# EAGLE design SparkFun GPS NEO_M9N_SMA _LONG (EAGLE 9.5.2)
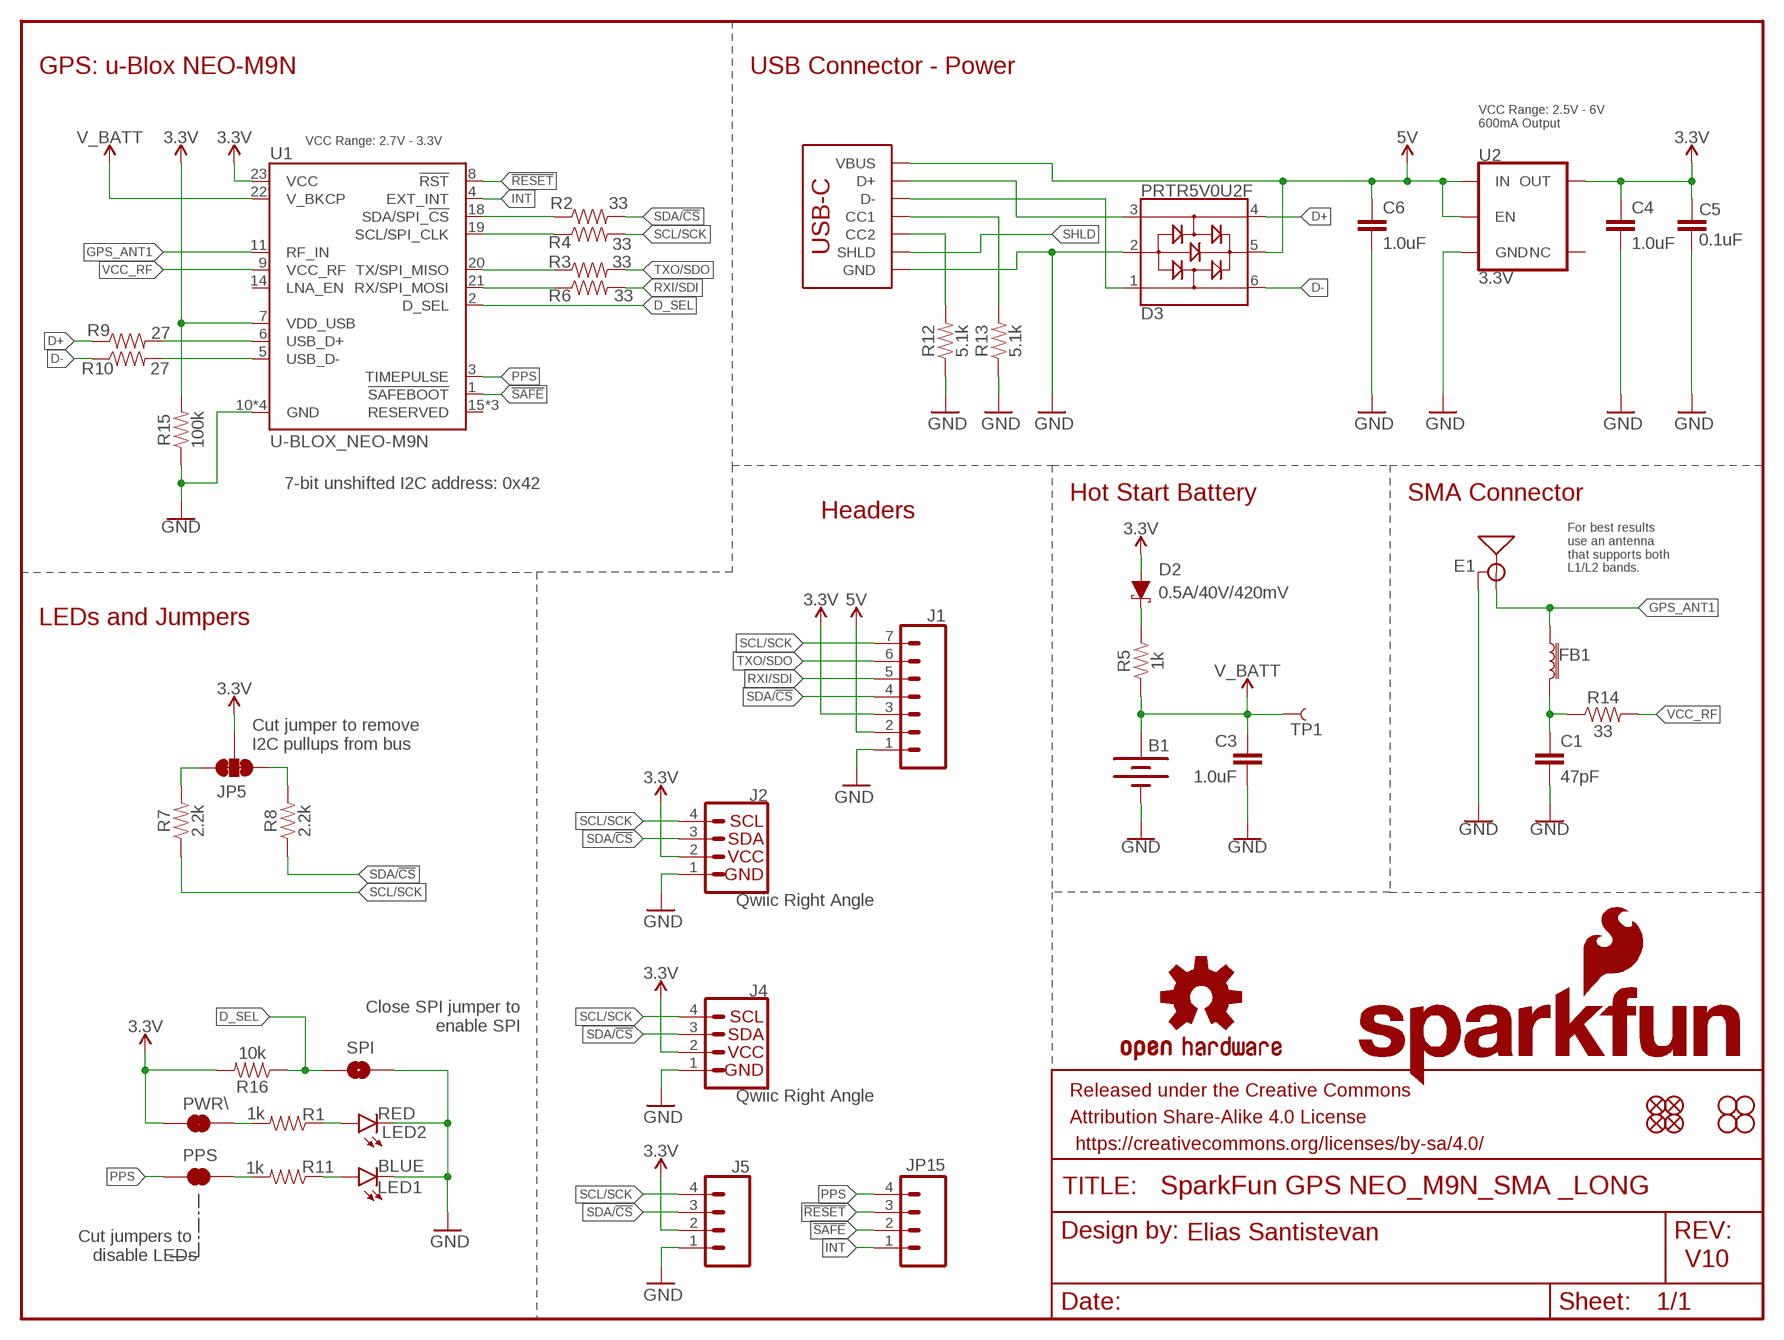
[diagram p0: schematic, sheet 1]

## Parts
B1  6.8MM_COIN_CELL  ML414H_IV01E_BATTERY  [ML414H_IV01E]
C1  47pF  47PF-0402-25V-5%-X7R  [0402]
C3  1.0uF  1.0UF-0603-16V-10%  [0603]
C4  1.0uF  1.0UF-0603-16V-10%  [0603]
C5  0.1uF  0.1UF-0603-25V-(+80/-20%)  [0603]
C6  1.0uF  1.0UF-0603-16V-10%  [0603]
D2  0.5A/40V/420mV  DIODE-SCHOTTKY-PMEG4005EJ  [SOD-323]
D3  PRTR5V0U2F  [SOT886]
E1  ANTENNA-GROUNDEDEDGE_RPSMA_SMD  [SMA-EDGE-SMD]
FB1  FERRITE_BEAD-120_OHM-0402  [0402]
FRAME1  FRAME-LETTER  [CREATIVE_COMMONS]
J1  CONN_07NO_SILK  [1X07_NO_SILK]
J2  Qwiic Right Angle  I2C_STANDARDQWIIC  [JST04_1MM_RA]
J3  USB_C_2-LAYER_PADS  [USB-C-16P-2LAYER-PADS]
J4  Qwiic Right Angle  I2C_STANDARDQWIIC  [JST04_1MM_RA]
J5  CONN_041X04_NO_SILK_NO_POP  [1X04_NO_SILK]
JP1  STAND-OFF  [STAND-OFF]
JP5  JUMPER-SMT_3_2-NC_TRACE_SILK  [SMT-JUMPER_3_2-NC_TRACE_SILK]
JP15  CONN_041X04_NO_SILK_NO_POP  [1X04_NO_SILK]
JP21  FIDUCIALUFIDUCIAL  [MICRO-FIDUCIAL]
JP31  STAND-OFF  [STAND-OFF]
JP61  FIDUCIALUFIDUCIAL  [MICRO-FIDUCIAL]
JP71  FIDUCIALUFIDUCIAL  [MICRO-FIDUCIAL]
JP81  FIDUCIALUFIDUCIAL  [MICRO-FIDUCIAL]
JP91  STAND-OFF  [STAND-OFF]
JP101  STAND-OFF  [STAND-OFF]
LED1  BLUE  LED-BLUE0603  [LED-0603]
LED2  RED  LED-RED0603  [LED-0603]
LOGO1  OSHW-LOGOMINI  [OSHW-LOGO-MINI]
LOGO2  SFE_LOGO_NAME_FLAME.1_INCH  [SFE_LOGO_NAME_FLAME_.1]
PPS  JUMPER-SMT_2_NC_TRACE_SILK  [SMT-JUMPER_2_NC_TRACE_SILK]
PWR\  JUMPER-SMT_2_NC_TRACE_SILK  [SMT-JUMPER_2_NC_TRACE_SILK]
R1  1k  1KOHM-0603-1/10W-1%  [0603]
R2  33  33OHM-0603-1/10W-1%  [0603]
R3  33  33OHM-0603-1/10W-1%  [0603]
R4  33  33OHM-0603-1/10W-1%  [0603]
R5  1k  1KOHM-0603-1/10W-1%  [0603]
R6  33  33OHM-0603-1/10W-1%  [0603]
R7  2.2k  2.2KOHM-0603-1/10W-1%  [0603]
R8  2.2k  2.2KOHM-0603-1/10W-1%  [0603]
R9  27  27OHM-0603-1/10W-1%  [0603]
R10  27  27OHM-0603-1/10W-1%  [0603]
R11  1k  1KOHM-0603-1/10W-1%  [0603]
R12  5.1k  5.1KOHM5.1KOHM-0603-1/10W-1%  [0603]
R13  5.1k  5.1KOHM5.1KOHM-0603-1/10W-1%  [0603]
R14  33  33OHM-0402-1/10W-1%  [0402]
R15  100k  100KOHM-0603-1/10W-1%  [0603]
R16  10k  10KOHM-0402-1/16W-1%  [0402]
SPI  JUMPER-SMT_2_NO_SILK  [SMT-JUMPER_2_NO_SILK]
TP1  TEST-POINT3X4  [PAD.03X.04]
U1  U-BLOX_NEO-M9N  [NEO-M9N/M8T/M8U]
U2  3.3V  V_REG_AP2112K-3.3V  [SOT23-5]

## Nets
3.3V [3.3V]: C4.1 C5.2 D2.A J1.3 J2.2 J4.2 J5.2 JP5.2 PWR\.2 R15.2 R16.2 U1.7(VDD_USB) U1.23(VCC) U2.5(OUT)
5V: C6.1 D3.5 J1.2 J3.VBUS1(VBUS) J3.VBUS2(VBUS) U2.1(IN) U2.3(EN)
!RESET: JP15.3 U1.8(!RST)
!SAFE: JP15.2 U1.1(!SAFEBOOT!)
D+: D3.4 R9.1
D-: D3.6 R10.1
D_SEL: R16.1 SPI.2 U1.2(D_SEL)
GND: B1.- C1.2 C3.2 C4.2 C5.1 C6.2 D3.2 E1.GND@0(GND) E1.GND@1(GND) J1.1 J2.1 J3.GND J3.GND2(GND) J4.1 J5.1 LED1.C LED2.C R12.1 R13.1 R15.1 SPI.1 U1.10(GND) U1.12(GND) U1.13(GND) U1.24(GND) U2.2(GND)
GPS_ANT1 [Antenna]: E1.SIG(SIGNAL) FB1.1 U1.11(RF_IN)
INT: JP15.1 U1.4(EXT_INT)
N$1: PWR\.1 R1.2
N$2: LED1.A R11.1
N$3: C1.1 FB1.2 R14.1
N$4: PPS.1 R11.2
N$5: JP5.1 R8.2
N$6: D2.C R5.2
N$7: J3.B5(CC2) R12.2
N$8: JP5.3 R7.2
N$9: J3.A5(CC1) R13.2
N$10: LED2.A R1.1
N$11: R9.2 U1.6(USB_D+)
N$12: R10.2 U1.5(USB_D-)
PPS: JP15.4 PPS.2 U1.3(TIMEPULSE)
RXI/SDI: J1.5 R6.2
RXLV: R6.1 U1.21(RX/SPI_MOSI)
SCL/SCK: J1.7 J2.4 J4.4 J5.4 R4.2 R7.1
SCL_LV: R4.1 U1.19(SCL/SPI_CLK)
SDA/!CS: J1.4 J2.3 J4.3 J5.3 R2.2 R8.1
SDA_LV: R2.1 U1.18(SDA/SPI_!CS!)
SHLD: J3.SHLD1(SHLD) J3.SHLD2(SHLD) J3.SHLD3(SHLD) J3.SHLD4(SHLD)
TXLV: R3.1 U1.20(TX/SPI_MISO)
TXO/SDO: J1.6 R3.2
USB_D+: D3.3 J3.A6(D+) J3.B6(D+)
USB_D-: D3.1 J3.A7(D-) J3.B7(D-)
V_BATT: B1.+ C3.1 R5.1 TP1.P$1 U1.22(V_BKCP)
VCC_RF: R14.2 U1.9(VCC_RF)
Unconnected: U1.14(LNA_EN) U1.15(RESERVED) U1.16(RESERVED) U1.17(RESERVED) U2.4(NC)

## Notes on the sheet
- GPS: u-Blox NEO-M9N | USB Connector - Power
- VCC Range: 2.5V - 6V 
  600mA Output
- VCC Range: 2.7V - 3.3V
- 7-bit unshifted I2C address: 0x42
- Hot Start Battery | SMA Connector
- Headers
- For best results
  use an antenna
  that supports both
  L1/L2 bands.
- LEDs and Jumpers
- Cut jumper to remove 
  I2C pullups from bus
- Close SPI jumper to
  enable SPI
- Cut jumpers to 
  disable LEDs
- Elias Santistevan
- V10

## Library data of the parts
B1 = SparkFun-Batteries:ML414H_IV01E_BATTERY: SEIKO ML414H-IV01E Reflowable Lithium Battery ML414H is a rechargeable, coin type battery with features such as Pb-free reflowable (Peak temperature: 260 C) and high temperature heat resistance. Battery Characteristics: 3.1V max voltage Voff is 2V 1mAH 3k series resistor with battery 72 hour charge time from 2.0-3.1V 2.3-2.8V initial charge; PROD_ID: BATT-14267
C1 = SparkFun-Capacitors:47PF: 47pF ceramic capacitors A capacitor is a passive two-terminal electrical component used to store electrical energy temporarily in an electric field.; PROD_ID: CAP-15063
C3 C4 C6 = SparkFun-Capacitors:1.0UF: 1µF ceramic capacitors A capacitor is a passive two-terminal electrical component used to store electrical energy temporarily in an electric field.; PROD_ID: CAP-00868
C5 = SparkFun-Capacitors:0.1UF: 0.1µF ceramic capacitors A capacitor is a passive two-terminal electrical component used to store electrical energy temporarily in an electric field.; PROD_ID: CAP-00810
D2 = SparkFun-DiscreteSemi:DIODE-SCHOTTKY: Schottky diode A Schottky diode is a semiconductor diode which has a low forward voltage drop and a very fast switching action.; PROD_ID: DIO-10955
D3 = SparkFun-IC-Power:PRTR5V0U2: A small ESD protection device. Most commonly used on USB D+/D- signals to protect large, expensive, or especially sensitive USB enabled devices.; PROD_ID: DIO-14084
E1 = SparkFun-RF:ANTENNA-GROUNDED: Antenna w/ Ground Connection 2.4GHz antennae with signal and ground terminals. TRACE_ANTENNA_2.4GHZ_15.2MM - Meander Trace antenna 15.2 x 5.7mm footprint Based on layout from TI app note AN043 <http://www.ti.com/lit/an/swra117d/swra117d.pdf>. TRACE_ANTENNA_2.4GHZ_25.7MM - Inverted F trace antenna 25.7 x 7.5 mm footprint. Based on layout from TI design note DN0007 <http://www.ti.com/lit/an/swru120b/swru120b.pdf>.; PROD_ID: CONN-15101
FB1 = SparkFun-Coils:FERRITE_BEAD-120_OHM: Ferrite Bead (blocks, cores, rings, chokes, etc.) Inductor with layers of ferrite used to suppress high frequencies. Often used to isolate high frequency noise.; MFG_PART: BLM15HB121SN1D; PROD_ID: NDUC-14206
FRAME1 = SparkFun-Aesthetics:FRAME-LETTER: Schematic Frame - Letter Standard 8.5x11 US Letter frame
J1 = SparkFun-Connectors:CONN_07: Multi connection point. Often used as Generic Header-pin footprint for 0.1 inch spaced/style header connections On any of the 0.1 inch spaced packages, you can populate with these: Break Away Headers - Straight <https://www.sparkfun.com/products/116> (PRT-00116) Break Away Male Headers - Right Angle <https://www.sparkfun.com/products/553> (PRT-00553) Female Headers <https://www.sparkfun.com/products/115> (PRT-00115) Break Away Headers - Machine Pin <https://www.sparkfun.com/products/117> (PRT-00117) Break Away Female Headers - Swiss Machine Pin <https://www.sparkfun.com/products/743> (PRT-00743) For SCREWTERMINALS and SPRING TERMINALS visit here: Screw Terimnals on SparkFun.com <https://www.sparkfun.com/search/results?term=Screw+Terminals> (5mm/3.5mm/2.54mm spacing) This device is also useful as a general connection point to wire up your design to another part of your project. Our various solder wires solder well into these plated through hole pads. Hook-Up Wire - Assortment (Stranded, 22 AWG) <https://www.sparkfun.com/products/11375> (PRT-11375) Hook-Up Wire - Assortment (Solid Core, 22 AWG) <https://www.sparkfun.com/products/11367> (PRT-11367) View the entire wire category on our website here <https://www.sparkfun.com/categories/141> Special notes: Molex polarized connector foot print use with SKU : PRT-08231 with associated crimp pins and housings. 1MM SMD Version SKU: PRT-10208 NOTES ON THE VARIANTS LOCK and LOCK_LONGPADS... This footprint was designed to help hold the alignment of a through-hole component (i.e. 6-pin header) while soldering it into place. You may notice that each hole has been shifted either up or down by 0.005 of an inch from it's more standard position (which is a perfectly straight line). This slight alteration caused the pins (the squares in the middle) to touch the edges of the holes. Because they are alternating, it causes a "brace" to hold the component in place. 0.005 has proven to be the perfect amount of "off-center" position when using our standard breakaway headers. Although looks a little odd when you look at the bare footprint, once you have a header in there, the alteration is very hard to notice. Also,if you push a header all the way into place, it is covered up entirely on the bottom side.
J2 J4 = SparkFun-Connectors:I2C_STANDARD: SparkFun I2C Standard Pinout Header SparkFun has standardized on a pinout for all I2C based sensor breakouts. This pinout allows I2C boards to be plugged directly into the headers on Arduino Uno compatible boards, and to be daisy chained easily. Example SparkFun Products: SparkFun Atmospheric Sensor Breakout - BME280 <https://www.sparkfun.com/products/13676> SparkFun Altitude/Pressure Sensor Breakout - MPL3115A2 <https://www.sparkfun.com/products/11084> SparkFun TOF Range Finder Sensor - VL6180 <https://www.sparkfun.com/products/12785>; PROD_ID: CONN-13694
J3 = SparkFun-Connectors:USB_C: USB Type C 16Pin Connector Super Speed pins not available on the 16-pin purely SMD connector so this part is best for USB 2.0 implementations. D1 and D2 are tied together enabling D+/- no matter which way the cable is plugged into the connector. The two channel configuration pins (CC1/2) are exposed. These are normally connected to ground via 5.1k resistors but can be reconfigured for high current/high power applications.; PROD_ID: CONN-14122
J5 JP15 = SparkFun-Connectors:CONN_04: Multi connection point. Often used as Generic Header-pin footprint for 0.1 inch spaced/style header connections On any of the 0.1 inch spaced packages, you can populate with these: Break Away Headers - Straight <https://www.sparkfun.com/products/116> (PRT-00116) Break Away Male Headers - Right Angle <https://www.sparkfun.com/products/553> (PRT-00553) Female Headers <https://www.sparkfun.com/products/115> (PRT-00115) Break Away Headers - Machine Pin <https://www.sparkfun.com/products/117> (PRT-00117) Break Away Female Headers - Swiss Machine Pin <https://www.sparkfun.com/products/743> (PRT-00743) For SCREWTERMINALS and SPRING TERMINALS visit here: Screw Terimnals on SparkFun.com <https://www.sparkfun.com/search/results?term=Screw+Terminals> (5mm/3.5mm/2.54mm spacing) This device is also useful as a general connection point to wire up your design to another part of your project. Our various solder wires solder well into these plated through hole pads. Hook-Up Wire - Assortment (Stranded, 22 AWG) <https://www.sparkfun.com/products/11375> (PRT-11375) Hook-Up Wire - Assortment (Solid Core, 22 AWG) <https://www.sparkfun.com/products/11367> (PRT-11367) View the entire wire category on our website here <https://www.sparkfun.com/categories/141> Special notes: Molex polarized connector foot print use with SKU : PRT-08231 with associated crimp pins and housings. 1MM SMD Version SKU: PRT-10208
JP1 JP31 JP91 JP101 = SparkFun:STAND-OFF: Stand Off This is the mechanical footprint for a #4 phillips button head screw. Use the keepout ring to avoid running the screw head into surrounding components. SKU : PRT-00447
JP5 = SparkFun-Jumpers:JUMPER-SMT_3_2-NC_TRACE: Normally closed trace jumper (2 of 2 connections) This jumper has a trace between all three pads so they are normally closed (NC). Use a razor knife to open the connection(s). For best results follow the IPC guidelines for cutting traces: Cutout at least 0.063 mm (0.005 in). Remove all loose material to clean up the cut area. Seal the cut with an approved epoxy. Reapply solder to reclose the connection(s).
JP21 JP61 JP71 JP81 = SparkFun:FIDUCIAL: Fiducial Alignment Points Various fiducial points for machine vision alignment.
LED1 = SparkFun-LED:LED-BLUE: Blue SMD LED Used in manufacturing of various products at SparkFun Packages: 0603 - SMD 0603 package [Product Link] <http://www.digikey.com/product-detail/en/SMLE12BC7TT86/511-1589-2-ND/1641808> 1206 - SMD1206 package [Product Link] <http://www.digikey.com/product-detail/en/lite-on-inc/LTST-C150TBKT/160-1643-1-ND/573584> SparkFun Products: ESP8266 Thing-Dev Board <https://www.sparkfun.com/products/13711> RedBoard <https://www.sparkfun.com/products/12757>; PROD_ID: DIO-08575
LED2 = SparkFun-LED:LED-RED: Red SMD LED Used in manufacturing of most products at SparkFun Packages: 0603 - SMD 0603 package [Product Link] <http://docs.avagotech.com/docs/AV02-0551EN> 0603 SMART - SMD 0603 SMART package ( more efficient and expensive)[Product Link] <http://www.osram-os.com/Graphics/XPic2/00077099_0.pdf> 1206 - SMD1206 package [Product Link] <https://www.sparkfun.com/datasheets/DevTools/LilyPad/Q150OVS4.pdff> SparkFun Products: Pro Mini 328 -5V <https://www.sparkfun.com/products/821> RedBoard <https://www.sparkfun.com/products/12757> IOIO-OTG <https://www.sparkfun.com/products/13613>; PROD_ID: DIO-00819
LOGO1 = SparkFun-Aesthetics:OSHW-LOGO: Open-Source Hardware (OSHW) Logo This logo indicates the piece of hardware it is found on incorporates a OSHW license and/or adheres to the definition of open source hardware found here: http://freedomdefined.org/OSHW
LOGO2 = SparkFun-Aesthetics:SFE_LOGO_NAME_FLAME: SparkFun Font Logo w/ Flame This is the SparkFun full logo. The logo on the schematic will always be the same size; the package variant is the height of the flame part of the logo. Default layer for the logo on the board is tSilk.
PPS PWR\ = SparkFun-Jumpers:JUMPER-SMT_2_NC_TRACE: Normally closed trace jumper This jumper has a trace between two pads so it's normally closed (NC). Use a razor knife to open the connection. For best results follow the IPC guidelines for cutting traces: Cutout at least 0.063 mm (0.005 in). Remove all loose material to clean up the cut area. Seal the cut with an approved epoxy. Reapply solder to reclose the connection.
R1 R5 R11 = SparkFun-Resistors:1KOHM: 1kΩ resistor A resistor is a passive two-terminal electrical component that implements electrical resistance as a circuit element. Resistors act to reduce current flow, and, at the same time, act to lower voltage levels within circuits. - Wikipedia; PROD_ID: RES-07856
R2-R4 R6 = SparkFun-Resistors:33OHM: 33Ω resistor A resistor is a passive two-terminal electrical component that implements electrical resistance as a circuit element. Resistors act to reduce current flow, and, at the same time, act to lower voltage levels within circuits. - Wikipedia; PROD_ID: RES-08270
R7 R8 = SparkFun-Resistors:2.2KOHM: 2.2kΩ resistor A resistor is a passive two-terminal electrical component that implements electrical resistance as a circuit element. Resistors act to reduce current flow, and, at the same time, act to lower voltage levels within circuits. - Wikipedia; PROD_ID: RES-08272
R9 R10 = SparkFun-Resistors:27OHM: 27Ω resistor A resistor is a passive two-terminal electrical component that implements electrical resistance as a circuit element. Resistors act to reduce current flow, and, at the same time, act to lower voltage levels within circuits. - Wikipedia; PROD_ID: RES-09334
R12 R13 = SparkFun-Resistors:5.1KOHM; PROD_ID: RES-12083
R14 = SparkFun-Resistors:33OHM: 33Ω resistor A resistor is a passive two-terminal electrical component that implements electrical resistance as a circuit element. Resistors act to reduce current flow, and, at the same time, act to lower voltage levels within circuits. - Wikipedia; PROD_ID: RES-14883
R15 = SparkFun-Resistors:100KOHM: 100kΩ resistor A resistor is a passive two-terminal electrical component that implements electrical resistance as a circuit element. Resistors act to reduce current flow, and, at the same time, act to lower voltage levels within circuits. - Wikipedia; PROD_ID: RES-07828
R16 = SparkFun-Resistors:10KOHM: 10kΩ resistor A resistor is a passive two-terminal electrical component that implements electrical resistance as a circuit element. Resistors act to reduce current flow, and, at the same time, act to lower voltage levels within circuits. - Wikipedia; PROD_ID: RES-14241
SPI = SparkFun-Jumpers:JUMPER-SMT_2_NO: Normally open jumper This jumper has two pads in close proximity to each other. Apply solder to close the connection. Round pads are easier to solder for beginners, but are a lot larger. SparkFun Product that uses the round pads: SparkFun EL Sequencer <https://www.sparkfun.com/products/12781>
TP1 = SparkFun-Connectors:TEST-POINT: SparkFun Test Points Bare copper test points for troubleshooting or In-Circuit-Testing. These are used by our Production team for verifying production board runs using pogo-pins on test beds. SparkFun Products: SparkFun LSM9DS1 Breakout <https://www.sparkfun.com/products/13284> SparkFun PSOC <https://www.sparkfun.com/products/13714> SparkFun Load Cell Amplifier <https://www.sparkfun.com/products/13879>
U1 = SparkFun-GPS:U-BLOX_NEO-M9N: u-blox NEO-M9N GPS Module The NEO-M9N module is built on the robust u-blox M9 GNSS chip, which provides exceptional sensitivity and acquisition times for all L1 GNSS systems. The u-blox M9 standard precision GNSS platform, which delivers meter-level accuracy, succeeds the well-known u-blox M8 product range. The receiver also provides higher navigation rate and improved security features compared to previous u-blox GNSS generations. The NEO-M9N module is available in the NEO form factor LLC package; PROD_ID: IC-14651
U2 = SparkFun-IC-Power:V_REG_AP2112: AP2112 - 600mA CMOS LDO Regulator w/ Enable The AP2112 is CMOS process low dropout linear regulator with enable function, the regulator delivers a guaranteed 600mA (min.) continuous load current. Features Output Voltage Accuracy: ±1.5% Output Current: 600mA (Min.) Foldback Short Current Protection: 50mA Enable Function to Turn ON/OFF VOUT Low Dropout Voltage (3.3V): 250mV (Typ.) @IOUT=600mA Excellent Load Regulation: 0.2%/A (Typ.) Excellent Line Regulation: 0.02%/V (Typ.) Low Quiescent Current: 55μA (Typ.) Low Standby Current: 0.01μA (Typ.) Low Output Noise: 50μVRMS PSRR: 100Hz -65dB, 1kHz -65dB OTSD Protection Stable with 1.0μF Flexible Cap: Ceramic, Tantalum and Aluminum Electrolytic Operation Temperature Range: -40°C to 85°C ESD: MM 400V, HBM 4000V; PROD_ID: VREG-12457

## Net classes
1 vcc: width 0.152 mm
2 3.3V: width 0.508 mm
3 Antenna: width 1 mm, clearance 0.3 mm

## Board
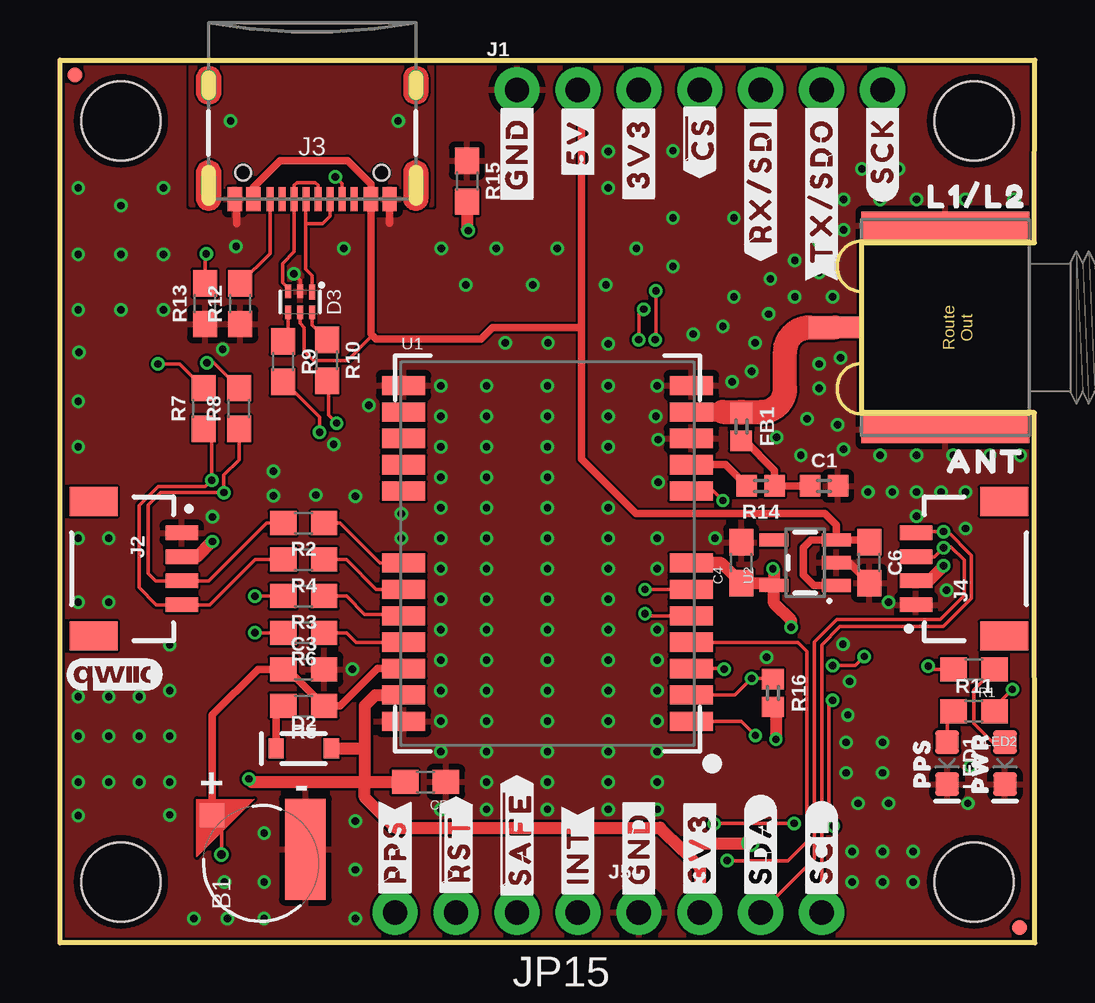
[diagram p1: board, top side]
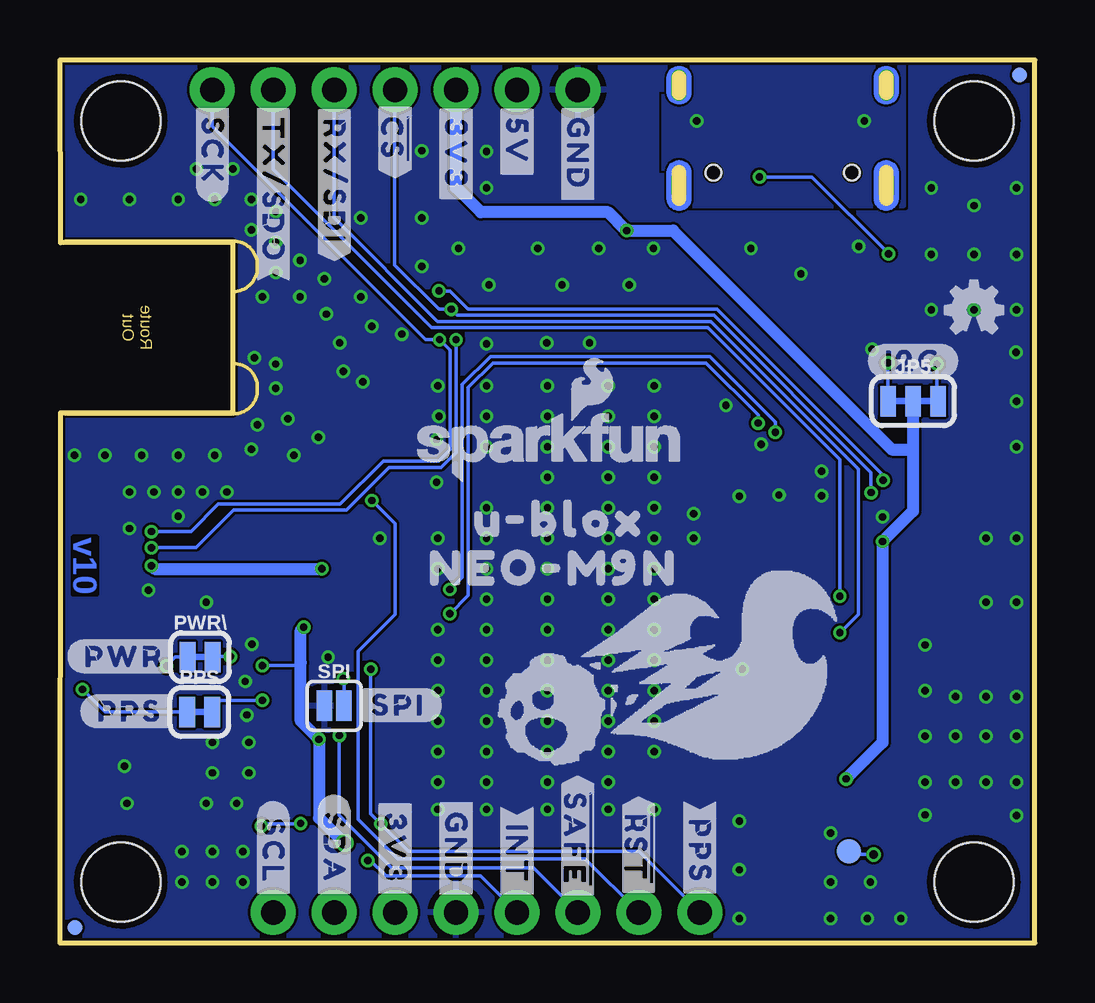
[diagram p2: board, bottom side, seen from below]

Size 40.64 x 36.8 mm. Coordinates in mm from the lower left corner, seen from the top.
Outline: 0,0 0,36.8 40.64,36.8 40.62,29.18 33.43,29.18 33.43,22.1 40.62,22.1 40.64,0 0,0
Copper layers (1*16): Top 0.035mm / dielectric 1.5mm / Bottom 0.035mm
Design rules "SparkFun-2-layer-FAB-LIMIT": minimum track width 4mil, minimum drill 6mil, track to track 4mil, track to pad 4mil, pad to pad 4mil, via to via 4mil, smd to smd 4mil, copper to edge 4mil, drill to drill 4mil, minimum pad ring 5mil, minimum via ring 5mil, stop-mask expansion 4mil, vias tented up to drill 25mil, thermal gap 10mil

### Footprints (pad centres in the part's own frame; a part is rotated, then mirrored left to right if it is on the bottom)
ML414H_IV01E = smd 1 x 1: + 2.022,2.032 | smd 4.2 x 1.7: - 0.6,-1.85
0402 = smd 0.85 x 0.9: 1 -0.58,0; 2 0.58,0
0603 = smd 1.1 x 1: 1 -0.85,0; 2 0.85,0
SOD-323 = smd 0.63 x 0.83: A 1.15,0; C -1.15,0
SOT886 = smd 0.61 x 0.25: 1 -0.405,0.5 | smd 0.56 x 0.25: 2 -0.43,0; 3 -0.43,-0.5; 4 0.43,-0.5; 5 0.43,0; 6 0.43,0.5
SMA-EDGE-SMD = smd 1.15 x 7: GND@0 -4.25,-3.5; GND@1 4.25,-3.5 | smd 0.9 x 2.2: SIG 0,-8.1
1X07_NO_SILK = drill 1.016 pad 1.88: 1 0,0; 2 2.54,0; 3 5.08,0; 4 7.62,0; 5 10.16,0; 6 12.7,0; 7 15.24,0
JST04_1MM_RA = smd 0.6 x 1.35: 1 -1.5,0; 2 -0.5,0; 3 0.5,0; 4 1.5,0 | smd 1.2 x 2: NC1 2.8,-3.675; NC2 -2.8,-3.675
USB-C-16P-2LAYER-PADS = smd 0.3 x 1: A5 -1.25,-0.34; A6 -0.25,-0.34; A7 0.25,-0.34; A8 1.25,-0.34; B5 1.75,-0.34; B6 0.75,-0.34; B7 -0.75,-0.34; B8 -1.75,-0.34 | smd 0.6 x 1: GND -3.225,-0.34; GND2 3.225,-0.34; VBUS1 -2.45,-0.34; VBUS2 2.45,-0.34 | drill 0.4 pad 0.6 long: SHLD1 -4.318,-0.915; SHLD2 4.318,-0.915; SHLD3 -4.318,-5.095; SHLD4 4.318,-5.095 | hole 0.65: -2.89,-1.445; 2.89,-1.445
1X04_NO_SILK = drill 1.016 pad 1.88: 1 0,0; 2 2.54,0; 3 5.08,0; 4 7.62,0
STAND-OFF = hole 3.302: 0,0
SMT-JUMPER_3_2-NC_TRACE_SILK = smd 0.66 x 1.27: 1 -1.041,0; 2 0,0; 3 1.041,0
MICRO-FIDUCIAL = smd 0.635 x 0.635: 1 0,0
LED-0603 = smd 1 x 1: A -0.877,0; C 0.877,0
SMT-JUMPER_2_NC_TRACE_SILK = smd 0.66 x 1.27: 1 -0.521,0; 2 0.521,0
SMT-JUMPER_2_NO_SILK = smd 0.635 x 1.27: 1 -0.406,0; 2 0.406,0
PAD.03X.04 = smd 1.016 x 1.016: P$1 0,0
NEO-M9N/M8T/M8U = smd 1.8 x 0.8: 1 6,-7; 2 6,-5.9; 3 6,-4.8; 4 6,-3.7; 5 6,-2.6; 6 6,-1.5; 7 6,-0.4; 8 6,2.6; 9 6,3.7; 10 6,4.8; 11 6,5.9; 12 6,7; 13 -6,7; 14 -6,5.9; 15 -6,4.8; 16 -6,3.7; 17 -6,2.6; 18 -6,-0.4; 19 -6,-1.5; 20 -6,-2.6; 21 -6,-3.7; 22 -6,-4.8; 23 -6,-5.9; 24 -6,-7
SOT23-5 = smd 0.55 x 1.2: 1 -0.95,-1.3; 2 0,-1.3; 3 0.95,-1.3; 4 0.95,1.3; 5 -0.95,1.3

### Placement (x,y rotation side)
B1  8.38,3.3 90 top
C1  31.85,19.05 0 top
C3  10.16,11.4 0 top
C4  28.4,15.85 90 top
C5  15.24,6.71 180 top
C6  33.73,15.85 270 top
D2  10.16,8.1 0 top
D3  10.01,26.72 270 top
E1  40.41,25.65 270 top
FB1  28.4,21.51 270 top
FRAME1  -17.78,-17.78 0 top  (outside the outline)
J1  19.05,35.56 0 top
J2  5.08,15.6 270 top
J3  10.52,30.66 180 top
J4  35.69,15.6 90 top
J5  24.13,1.27 0 top
JP1  38.1,34.26 0 top
JP5  5.08,22.58 0 bottom
JP15  21.59,1.27 180 top
JP21  40.01,0.64 0 top
JP31  2.54,34.26 0 top
JP61  0.64,36.17 0 top
JP71  40.01,0.64 0 bottom
JP81  0.64,36.17 0 bottom
JP91  2.54,2.54 0 top
JP101  38.1,2.54 0 top
LED1  36.98,7.49 270 top
LED2  39.4,7.49 270 top
LOGO1  2.54,26.39 0 bottom
LOGO2  20.19,20.68 0 bottom
PPS  34.82,9.63 0 bottom
PWR\  34.8,11.91 0 bottom
R1  38.1,11.4 180 top
R2  10.16,17.5 180 top
R3  10.16,14.45 180 top
R4  10.16,15.98 180 top
R5  10.16,9.88 180 top
R6  10.16,12.93 180 top
R7  5.99,22.28 90 top
R8  7.47,22.28 90 top
R9  9.3,24.23 270 top
R10  11.13,24.28 270 top
R11  38.1,9.65 0 top
R12  7.52,26.64 90 top
R13  6.05,26.64 90 top
R14  29.21,19.05 180 top
R15  16.97,31.75 270 top
R16  29.72,10.41 270 top
SPI  29.21,9.88 0 bottom
TP1  7.75,3.81 0 bottom
U1  20.32,16.23 0 top
U2  31.06,15.85 90 top
U$1  [##CS##9]  26.67,33.53 90 top
U$2  [U#BLOX19]  19.81,17.65 0 bottom
U$3  [##SAFE##15]  19.05,4.32 90 top
U$4  [#3V3#6]  26.67,3.94 90 top
U$5  [#3V3#6]  24.13,32.89 90 top
U$6  [#5V#1]  21.59,33.4 90 top
U$7  [#GND#0]  24.13,3.94 90 top
U$8  [#GND#0]  19.05,32.89 90 top
U$9  [#INT#16]  21.59,3.68 90 top
U$10  [PPS7]  35.94,7.49 90 top
U$11  [#PPS#13]  13.97,3.81 90 top
U$12  [#SPI#22]  26.54,9.91 0 bottom
U$13  [PWR6]  38.35,7.49 90 top
U$14  [QWIIC_4MM]  2.29,11.18 0 top
U$15  [#RX#SDI#10]  29.21,31.75 90 top
U$16  [#SCK#12]  34.29,33.02 90 top
U$17  [#PWR#1]  37.97,11.94 0 bottom
U$18  [#SCL#18]  31.75,3.81 90 top
U$19  [#SDA#17]  29.21,3.94 90 top
U$20  [#TX#SDO#11]  31.75,31.37 90 top
U$21  [NEO_GPS_BOARD_SILK_FINAL#03#JPG]  15.24,11.43 0 bottom
U$22  [##SAFE##11]  19.05,4.32 270 bottom
U$23  [L1#L28]  38.23,31.11 0 top
U$24  [ANT8]  38.61,20.07 0 top
U$25  [NEO#M9N20]  20.07,15.62 0 bottom
U$26  [##CS##6]  26.67,33.53 270 bottom
U$27  [##RST##12]  16.51,3.94 270 bottom
U$28  [##RST##2]  16.51,3.94 90 top
U$29  [#I2C#3]  5.08,24.26 0 bottom
U$30  [#INT#10]  21.59,3.68 270 bottom
U$31  [#PPS#0]  37.72,9.65 0 bottom
U$32  [#PPS#13]  13.97,3.81 270 bottom
U$33  [#RX#SDI#4]  29.21,31.75 270 bottom
U$34  [#SCK#3]  34.29,33.02 270 bottom
U$35  [#SCL#8]  31.75,3.81 270 bottom
U$36  [#SDA#9]  29.21,3.94 270 bottom
U$37  [#TX#SDO#5]  31.75,31.37 270 bottom
U$38  [#GND#0]  19.05,32.89 270 bottom
U$39  [#3V3#6]  24.13,32.89 270 bottom
U$40  [#3V3#6]  26.67,3.94 270 bottom
U$41  [#GND#0]  24.13,3.94 270 bottom
U$42  [#5V#1]  21.59,33.4 270 bottom

### Tracks (layer width: path | path; a pad name or v marks a point on that pad's centre or on a via)
3.3V  (via drill 0.3, 0.51)
  Top 0.152: v33.53,11.94 33.15,11.56 v32.21,11.56
  Top 0.508: U2.5 29.66,15 C4.1 27.57,15.83 U1.7 | v29.72,15.6 29.76,15.55 U2.5 | J4.2 36.23,15.1 36.83,15.7 v36.83,15.72 | v30.48,13.16 30.48,13.44 29.76,14.15 U2.5 | 25.96,3.86 25.02,4.8 13.97,4.8 12.7,6.07 12.7,6.71 | 25.96,3.86 26.67,3.15 J5.2 | 12.7,8.1 12.7,9.88 13.15,10.33 U1.23 | v7.87,6.83 8,6.71 12.7,6.71 | D2.A 12.7,8.1 | R15.2 16.97,29.74 v17.02,29.69 | 25.96,3.86 26.24,4.14 28.75,4.14 v28.78,4.17 | 12.7,6.71 C5.2 | 12.7,8.1 12.7,6.71 | R16.2 29.84,9.71 v29.84,8.48 | J2.2 5.71,16.1 v6.35,16.73
  Bottom 0.152: v32.21,11.56 30.73,11.56 30.61,11.68 | v33.53,11.94 34.04,11.94 34.06,11.91 PWR\.2
  Bottom 0.508: v36.83,15.72 36.7,15.6 v29.72,15.6 | v7.87,6.83 6.35,8.36 v6.35,16.73 5.08,18 5.08,20.57 | v30.48,13.16 30.61,13.03 30.61,11.68 30.61,9.25 v29.84,8.48 29.84,5.21 28.8,4.17 v28.78,4.17 | JP5.2 5.08,20.57 | 5.08,20.57 5.97,20.57 15.09,29.69 v17.02,29.69 17.78,30.45 23.09,30.45 24.13,31.5 J1.3
5V
  Top 0.152: D3.5 10.01,25.83 10.19,25.65 10.19,24.66 10.57,24.28 11.98,24.28 12.98,25.27 13.08,25.27
  Top 0.254: 33.65,16.78 C6.1 | J1.2 21.74,35.41 21.74,35.38
  Top 0.305: 33.65,16.78 33.66,16.78 33.63,16.8 U2.3 | U2.3 31.3,16.8 30.99,16.48 30.99,15.34 31.43,14.9 U2.1 | J3.VBUS2 8.07,31.51 9.17,32.61 11.99,32.61 12.97,31.64 J3.VBUS1 12.97,25.39 13.08,25.27 13.18,25.17 17.55,25.17 18.03,25.65 21.74,25.65 | 21.74,35.38 21.74,25.65 | 21.74,25.65 21.74,20.17 24,17.91 31.88,17.91 32.36,17.42 U2.3
!RESET  (via drill 0.3)
  Top 0.152: v27.64,18.44 27.25,18.83 U1.8
  Bottom 0.152: JP15.3 18.75,3.5 26.57,3.5 28.22,5.16 28.22,12.14 26.67,13.69 26.67,17.48 v27.64,18.44
!SAFE  (via drill 0.3)
  Top 0.152: v28.99,8.64 28.41,9.23 U1.1
  Bottom 0.152: JP15.2 20.9,3.12 26.82,3.12 29.01,5.31 29.01,8.63 v28.99,8.64
D+
  Top 0.152: R9.1 9.51,25.29 D3.4
D-
  Top 0.152: R10.1 10.51,25.75 D3.6
D_SEL  (via drill 0.3)
  Top 0.152: U1.2 28.14,10.33 v28.83,11.02 29.69,11.02
  Top 0.254: 29.69,11.02 R16.1
  Bottom 0.152: SPI.2 28.8,11 v28.83,11.02
GND  (via drill 0.3)
  Top 0.152: D3.2 10.01,27.64 v9.75,27.89
  Top 0.305: U2.2 32.88,15.85 C6.2 | J3.GND2 7.37,30.92 7.37,29.97 | J3.GND 13.74,30
  other vias: 6.35,17.75 32.84,9.5 32.64,12.45 33.27,5.82 33.02,3.81 15.88,9.25 17.78,9.25 8.51,2.54 12.19,11.4 12.88,22.4 36.96,14.71 20.32,9.25 22.86,9.25 24.89,9.25 15.88,10.52 17.78,10.52 20.32,10.52 22.86,10.52 24.89,10.52 15.88,11.79 17.78,11.79 20.32,11.79 22.86,11.79 24.89,11.79 15.88,13.06 17.78,13.06 20.32,13.06 22.86,13.06 24.89,13.06 15.88,14.33 17.78,14.33 20.32,14.33 22.86,14.33 15.88,15.6 17.78,15.6 20.32,15.6 22.86,15.6 24.89,15.6 15.88,16.87 17.78,16.87 20.32,16.87 22.86,16.87 24.89,16.87 15.88,18.14 17.78,18.14 20.32,18.14 22.86,18.14 15.88,19.41 17.78,19.41 20.32,19.41 24.94,19.2 15.88,20.68 17.78,20.68 20.32,20.68 22.86,20.68 24.94,20.98 15.88,21.95 17.78,21.95 20.32,21.95 22.86,21.95 24.84,21.95 15.88,23.22 17.78,23.22 20.32,23.22 22.86,23.22 24.89,23.22 22.86,31.47 22.86,32.99 27.3,16.87 33.02,2.54 35.56,2.54 35.56,3.81 6.86,2.54 5.59,1.02 0.79,24.61 0.76,26.39 0.76,31.47 0.76,14.2 0.76,16.87 0.76,20.68 0.76,22.58 0.76,5.31 0.76,6.71 0.76,8.61 0.76,10.26 2.03,6.71 2.03,8.61 2.03,10.26 3.3,6.71 3.3,8.61 3.3,10.26 4.57,5.33 4.57,6.71 4.57,8.61 4.57,10.52 4.57,12.42 15.88,7.98 17.78,7.98 20.32,7.98 22.86,7.98 24.89,7.98 17.78,6.71 20.32,6.71 22.86,6.71 24.89,6.71 15.88,5.56 17.78,5.56 20.32,5.56 22.86,5.56 24.89,5.56 2.54,26.39 4.32,26.39 4.32,31.47 7.34,29.03 14.22,16.87 14.22,17.88 12.32,18.62 10.67,18.67 34.29,2.54 34.29,3.81 32.77,8.36 34.29,8.36 2.03,14.2 2.03,16.87 29.54,26.21 28.02,23.39 6.99,1.02 12.32,3.05 12.32,5.08 8.51,4.57 37.95,7.37 34.29,7.09 32.77,7.09 37.85,5.82 34.54,5.82 8.51,1.02 12.32,1.02 29.46,11.91 8.89,19.66 8.89,18.64 22.86,24.97 18.57,25.02 20.35,25.02 26.39,25.37 6.78,24.74 34.54,14.2 32.92,10.9 28.83,23.83 31.65,24.13 31.65,23.11 29.87,21.08 31.14,21.84 32.41,21.59 32.66,20.57 30.89,20.32 32.21,26.92 32.66,29.72 32.66,30.99 34.19,30.99 34.95,32.26 33.43,32.26 31.65,30.48 34.19,20.32 35.71,20.32 33.68,18.8 34.7,18.8 35.71,18.8 36.73,18.8 37.74,18.8 35.71,17.78 37.74,17.27 31.65,27.94 31.65,29.21 30.63,28.45 30.63,26.92 29.62,27.69 28.09,26.92 39.78,30.99 37.74,30.99 35.71,30.99 0.76,28.7 2.54,28.7 4.32,28.7 2.54,30.73 37.24,20.32 38.76,20.32 40.03,20.32 27.64,25.7 28.98,25.02 25.55,33.02 25.55,30.23 24.03,28.96 20.73,28.96 18.19,28.96 15.9,28.96 16.92,27.43 19.71,27.43 22.76,27.43 25.55,28.19 11.41,20.78 11.84,28.96 28.09,30.23 32.54,24.38
  pour Top (rank 2): 0,36.8 40.64,36.8 40.64,29.21 33.4,29.21 33.4,22.1 40.64,22.1 40.64,0 0,0
  pour Bottom (rank 2): 0,36.8 40.64,36.8 40.64,29.21 33.4,29.21 33.4,22.1 40.64,22.1 40.64,0 0,0
GPS_ANT1
  Top 0.8: U1.11 27.63,22.13
  Top 1: E1.SIG 31.24,25.65 arc90 30.23,24.64 30.23,23.11 arc-90 29.24,22.13 28.43,22.13 arc90 FB1.1 arc90 28.36,22.13 27.63,22.13
INT  (via drill 0.3)
  Top 0.152: v27.81,3.43 30.35,3.43 31.14,4.22 31.14,12.14 30.75,12.53 U1.4
  Bottom 0.152: JP15.1 23.11,2.79 27.05,2.79 27.69,3.43 v27.81,3.43
N$1  (via drill 0.3)
  Top 0.152: v36.2,11.53 36.32,11.4 R1.2
  Bottom 0.152: PWR\.1 35.84,11.91 36.2,11.56 v36.2,11.53
N$2
  Top 0.152: LED1.A 36.98,9.38 R11.1
N$3
  Top 0.254: FB1.2 28.55,20.93
  Top 0.305: C1.1 R14.1 29.79,19.69 28.55,20.93
N$4  (via drill 0.3)
  Top 0.152: v39.7,10.57 38.95,9.82 R11.2
  Bottom 0.152: v39.7,10.57 38.76,9.63 PPS.1
N$5  (via drill 0.3)
  Top 0.152: R8.2 6.41,24.18 v6.12,24.18
  Bottom 0.152: v6.12,24.18 JP5.1
N$6
  Top 0.152: 9.01,9.58 R5.2
  Top 0.305: D2.C 9.01,9.58
N$7
  Top 0.152: R12.2 8.77,28.74 J3.B5
N$8  (via drill 0.3)
  Top 0.152: v4.09,24.13 4.99,24.13 R7.2
  Bottom 0.152: v4.09,24.13 4.09,22.63 arc-90 JP5.3
N$9  (via drill 0.3)
  Top 0.152: J3.A5 11.77,31.64 v11.48,31.93 | v6.1,28.73 6.04,28.68 R13.2
  Bottom 0.152: v11.48,31.93 9.3,31.93 v6.1,28.73
N$10
  Top 0.152: R1.1 38.1,10.55 38.1,9.14 38.87,8.37 LED2.A
N$11  (via drill 0.3)
  Top 0.152: R9.2 9.36,23.38 10.82,21.92 v10.82,21.29 | U1.6 v24.39,14.73 v24.38,14.73
  Bottom 0.152: v10.82,21.29 10.82,21.72 13.55,24.45 22.7,24.45 23.88,23.27 23.88,15.24 v24.38,14.73
N$12  (via drill 0.3)
  Top 0.152: R10.2 11.2,23.36 11.2,22 v11.53,21.67 | U1.5 24.47,13.63 v24.38,13.72
  Bottom 0.152: v11.53,21.67 11.53,22 13.7,24.17 22.59,24.17 23.62,23.14 23.62,14.48 v24.38,13.72
PPS  (via drill 0.3)
  Top 0.152: v32.21,10.11 32.05,9.96 32.05,5.05 v32.24,4.87 | v30.61,4.98 27.29,4.98 v27.27,4.96 | U1.3 27.66,11.43 v27.69,11.4
  Bottom 0.152: JP15.4 16.51,3.81 26.12,3.81 v27.27,4.96 27.69,5.38 v27.69,11.4 | v32.24,4.87 32.14,4.97 v30.61,4.97 v30.61,4.98 | PPS.2 34.54,9.87 34.54,10.16 34.49,10.11 33.53,10.11 v32.21,10.11
RXI/SDI  (via drill 0.3)
  Top 0.152: R6.2 v8.13,12.93
  Bottom 0.152: v8.13,12.93 7.37,13.69 7.37,19.76 13.51,25.91 24.89,25.91 29.21,30.23 J1.5
RXLV
  Top 0.152: R6.1 11.94,12.93 12.34,12.53 U1.21
SCL/SCK  (via drill 0.3)
  Top 0.152: R4.2 8.13,15.98 6.25,14.1 J2.4 4.01,14.1 3.3,14.81 3.3,18.24 4.09,19.02 6.05,19.02 6.33,19.3 | J4.4 35.74,17.15 v36.83,17.15 37.01,17.15 38,16.16 38,14.35 36.83,13.18 32.51,13.18 31.75,12.42 J5.4 | v24.84,27.18 24.84,25.17 v24.82,25.15 | v6.33,19.28 6.33,19.3 | 6.33,19.3 6.33,21.09 R7.1
  Bottom 0.152: v6.33,19.28 6.33,19.48 13.26,26.42 23.62,26.42 24.38,27.18 v24.84,27.18 | v36.83,17.15 35.18,17.15 34.04,18.29 28.96,18.29 27.15,20.09 24.87,20.09 24.38,20.57 24.38,24.71 v24.82,25.15 25.4,25.15 34.29,34.04 J1.7
SCL_LV
  Top 0.152: R4.1 11.94,15.98 13.18,14.73 U1.19
SDA/!CS  (via drill 0.3)
  Top 0.152: J4.3 36.45,16.1 v36.83,16.48 36.86,16.51 37.13,16.51 37.69,15.95 37.69,14.48 36.7,13.49 32.39,13.49 31.45,12.55 31.45,3.5 J5.3 | v24.13,25.15 24.13,26.21 v24.33,26.42 | R8.1 7.47,20.13 6.83,19.5 v6.83,18.77 4.19,18.77 3.68,18.26 3.68,15.39 3.98,15.1 J2.3 6.21,15.1 8.61,17.5 R2.2
  Bottom 0.152: v6.83,18.77 6.83,19.61 13.39,26.16 24.08,26.16 v24.33,26.42 24.84,26.42 26.68,28.26 26.68,35.55 J1.4 | v36.83,16.48 34.96,16.48 33.4,18.03 28.7,18.03 26.92,19.81 24.77,19.81 24.13,20.45 v24.13,25.15
SDA_LV
  Top 0.152: R2.1 11.68,17.5 13.35,15.83 U1.18
SHLD  (via drill 0.3)
  other vias: 14.1,34.26 7.11,34.26
  pour Bottom: 15.49,36.8 15.49,30.73 5.46,30.73 5.46,36.8
  pour Top: 15.49,36.8 15.49,30.76 5.46,30.76 5.46,36.8
TXLV
  Top 0.152: R3.1 11.94,14.45 12.7,13.69 14.26,13.69 U1.20
TXO/SDO  (via drill 0.3)
  Top 0.152: R3.2 v8.13,14.45
  Bottom 0.152: v8.13,14.45 8.13,20.14 13.64,25.65 25.15,25.65 31.75,32.26 J1.6
USB_D+
  Top 0.152: D3.3 9.51,27.28 9.27,27.51 9.27,28.32 9.77,28.82 J3.B6 9.77,31.58 9.88,31.7 10.64,31.7 10.77,31.58 J3.A6
USB_D-
  Top 0.152: 10.24,29.97 10.24,30.97 J3.A7 | 10.24,29.97 10.24,28.09 10.51,27.82 D3.1 | J3.B7 11.27,30.29 10.95,29.97 10.24,29.97
V_BATT  (via drill 0.35)
  Top 0.152: 9.49,11.4 C3.1 | B1.+ 6.73,4.94 v6.73,3.68
  Top 0.305: 9.49,11.4 R5.1 11.68,9.88 13.23,11.43 U1.22 | C3.1 8.26,11.4 6.35,9.5 B1.+
  Bottom 0.152: v6.73,3.68 7.62,3.68 TP1.P$1
VCC_RF
  Top 0.305: U1.9 27.75,19.93 R14.2

### Text on the board
Bottom: v10
tPlace: + | -
tDocu: Elias Santistevan